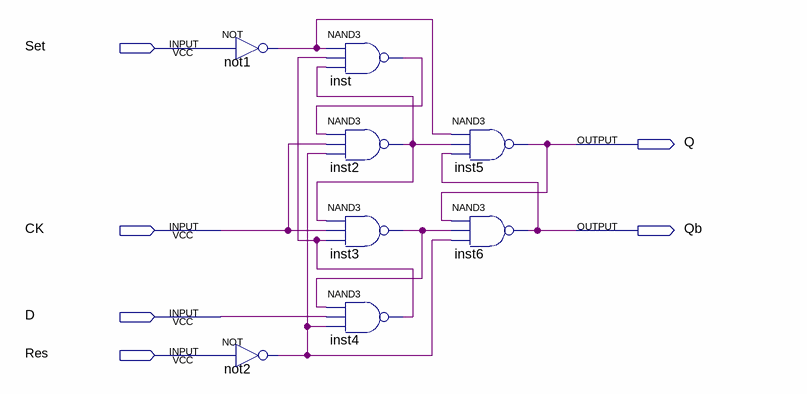
[diagram p0: schematic sheet]
// Quartus schematic cus_dff_2.bdf as structural Verilog: 8 symbols, 6 pins
module cus_dff_2 (
  input  Set,
  input  CK,
  input  D,
  input  Res,
  output Q,
  output Qb
);

  wire inst2_out, inst3_out, inst4_out, inst_out, not1_out, not2_out;

  not not1 (not1_out, Set);
  not not2 (not2_out, Res);
  nand inst (inst_out, not1_out, inst4_out, inst2_out);
  nand inst2 (inst2_out, inst_out, CK, not2_out);
  nand inst3 (inst3_out, inst2_out, CK, inst4_out);
  nand inst4 (inst4_out, inst3_out, D, not2_out);
  nand inst5 (Q, not1_out, inst2_out, Qb);
  nand inst6 (Qb, Q, inst3_out, not2_out);
endmodule
